# EasyEDA Pro project PCB_Board.epro

# Board PCB_Board
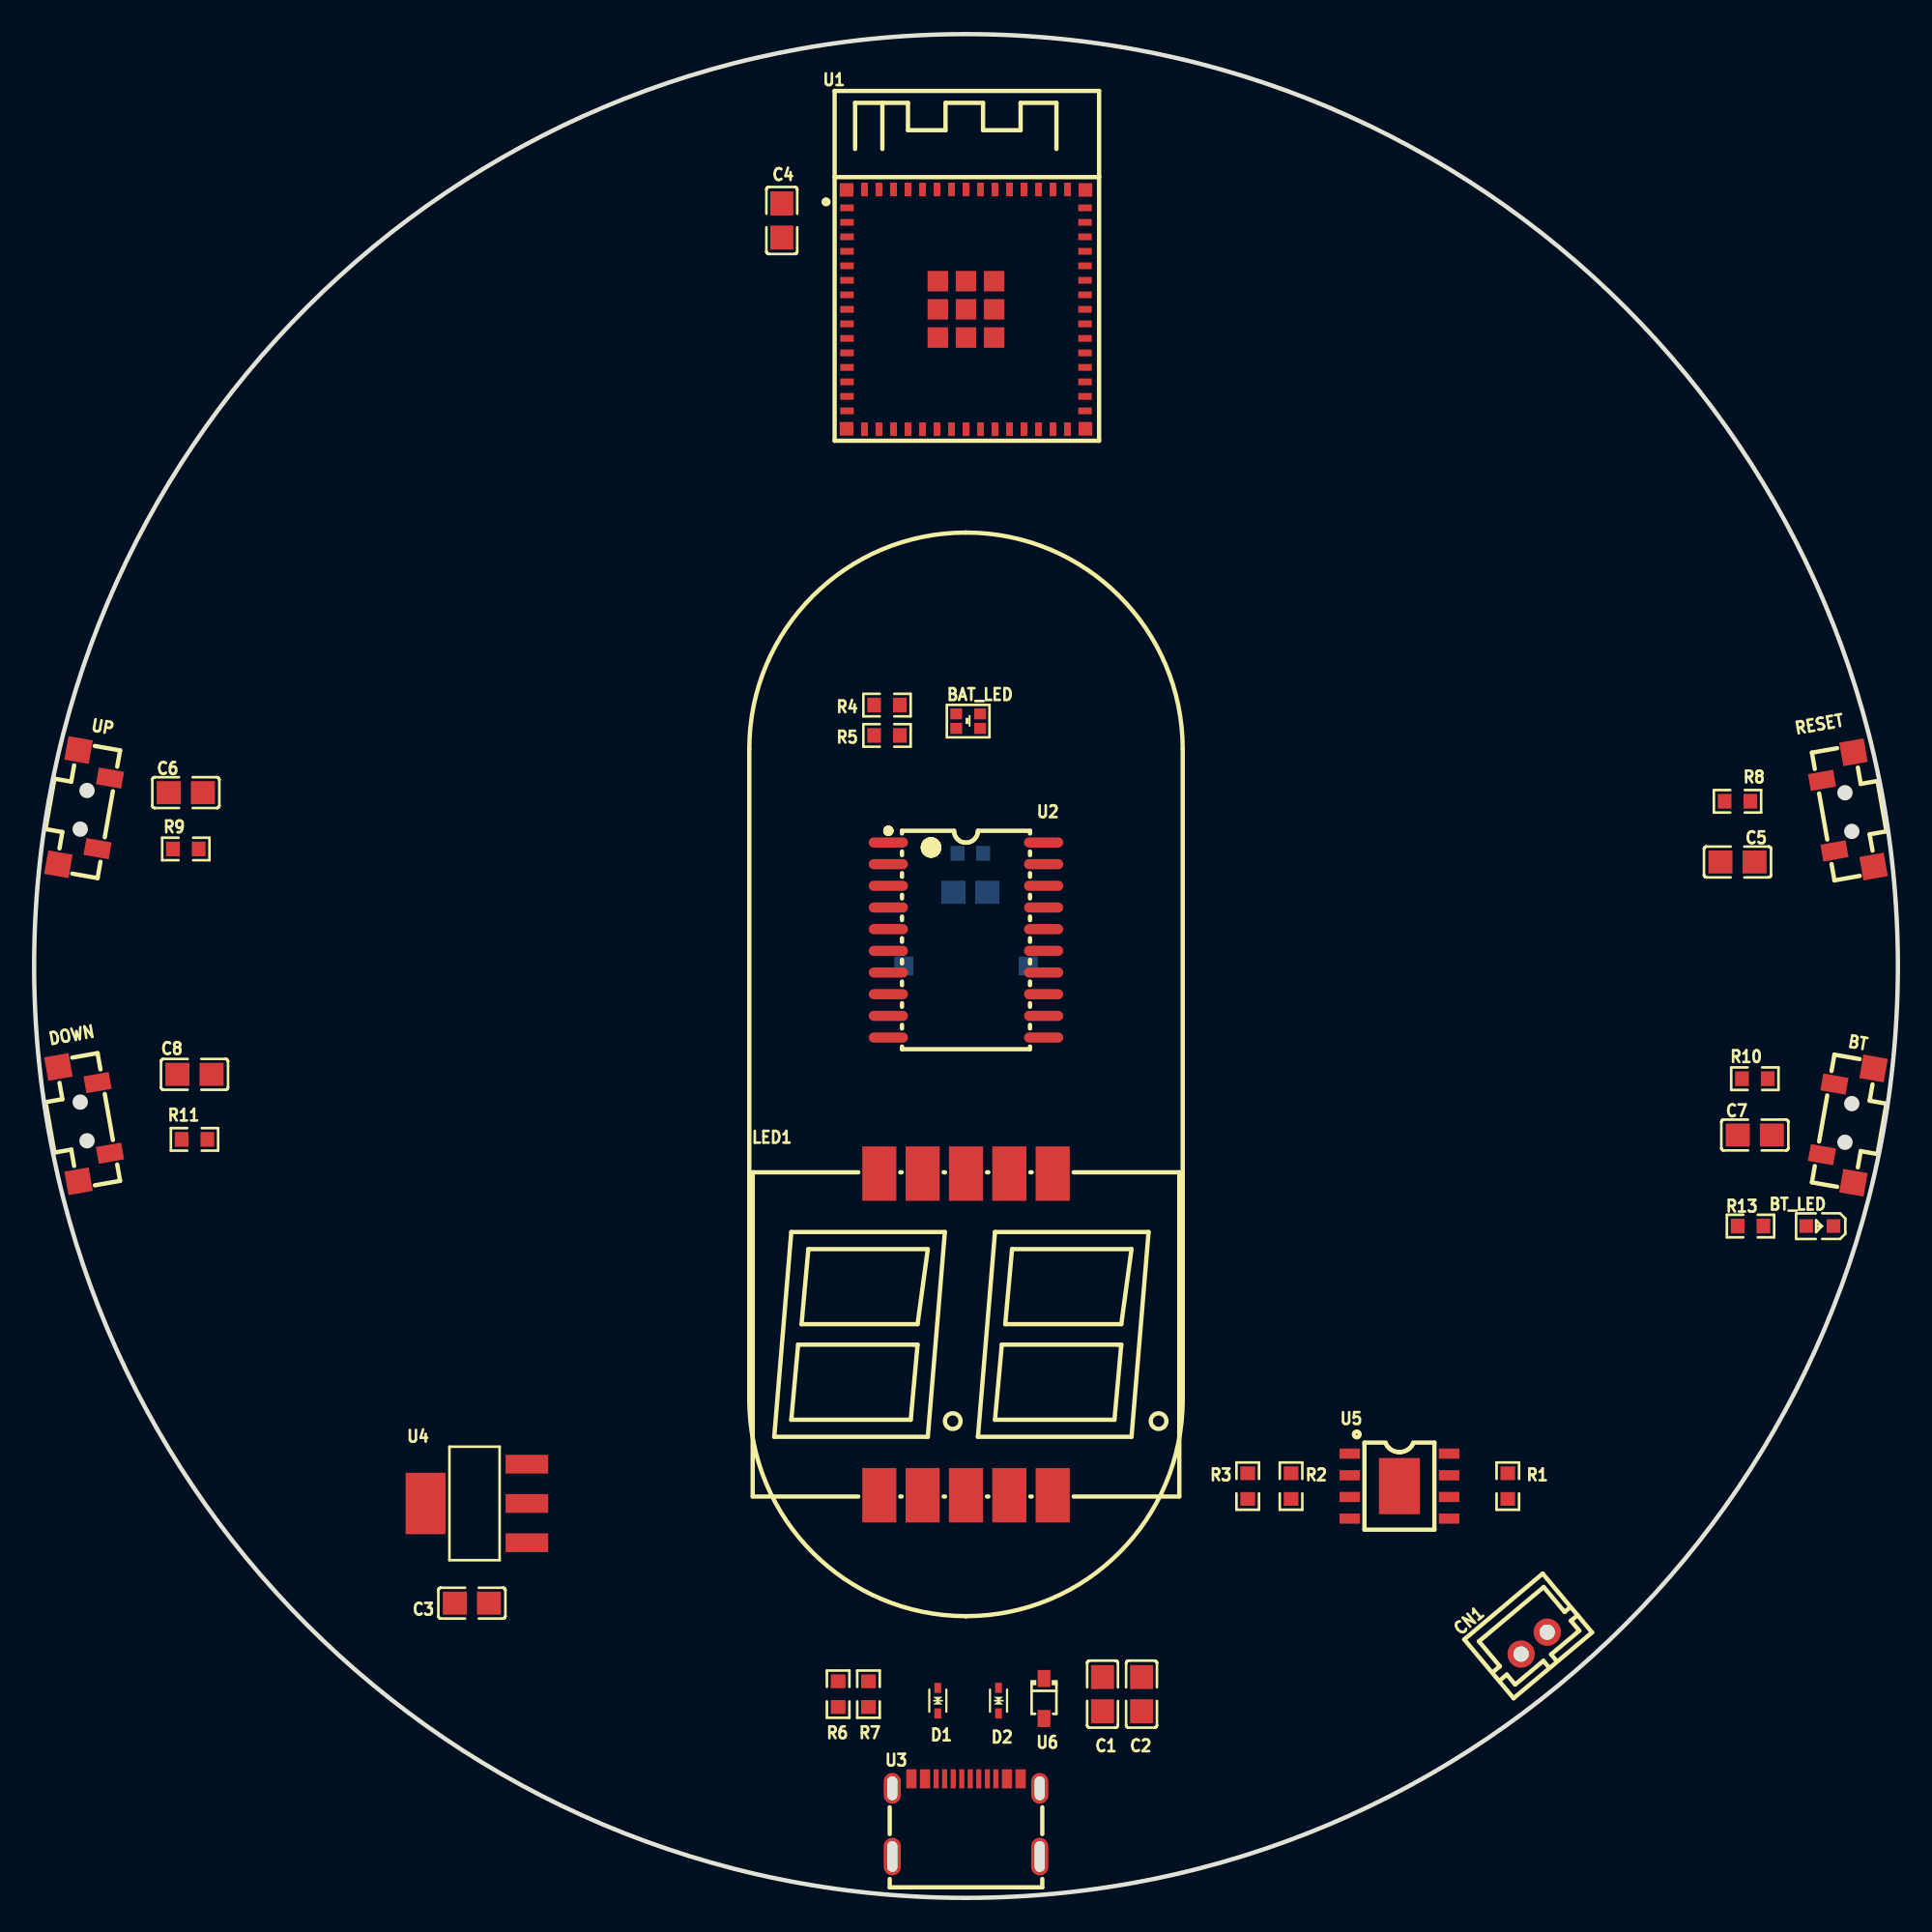
[diagram p0: board, top side]
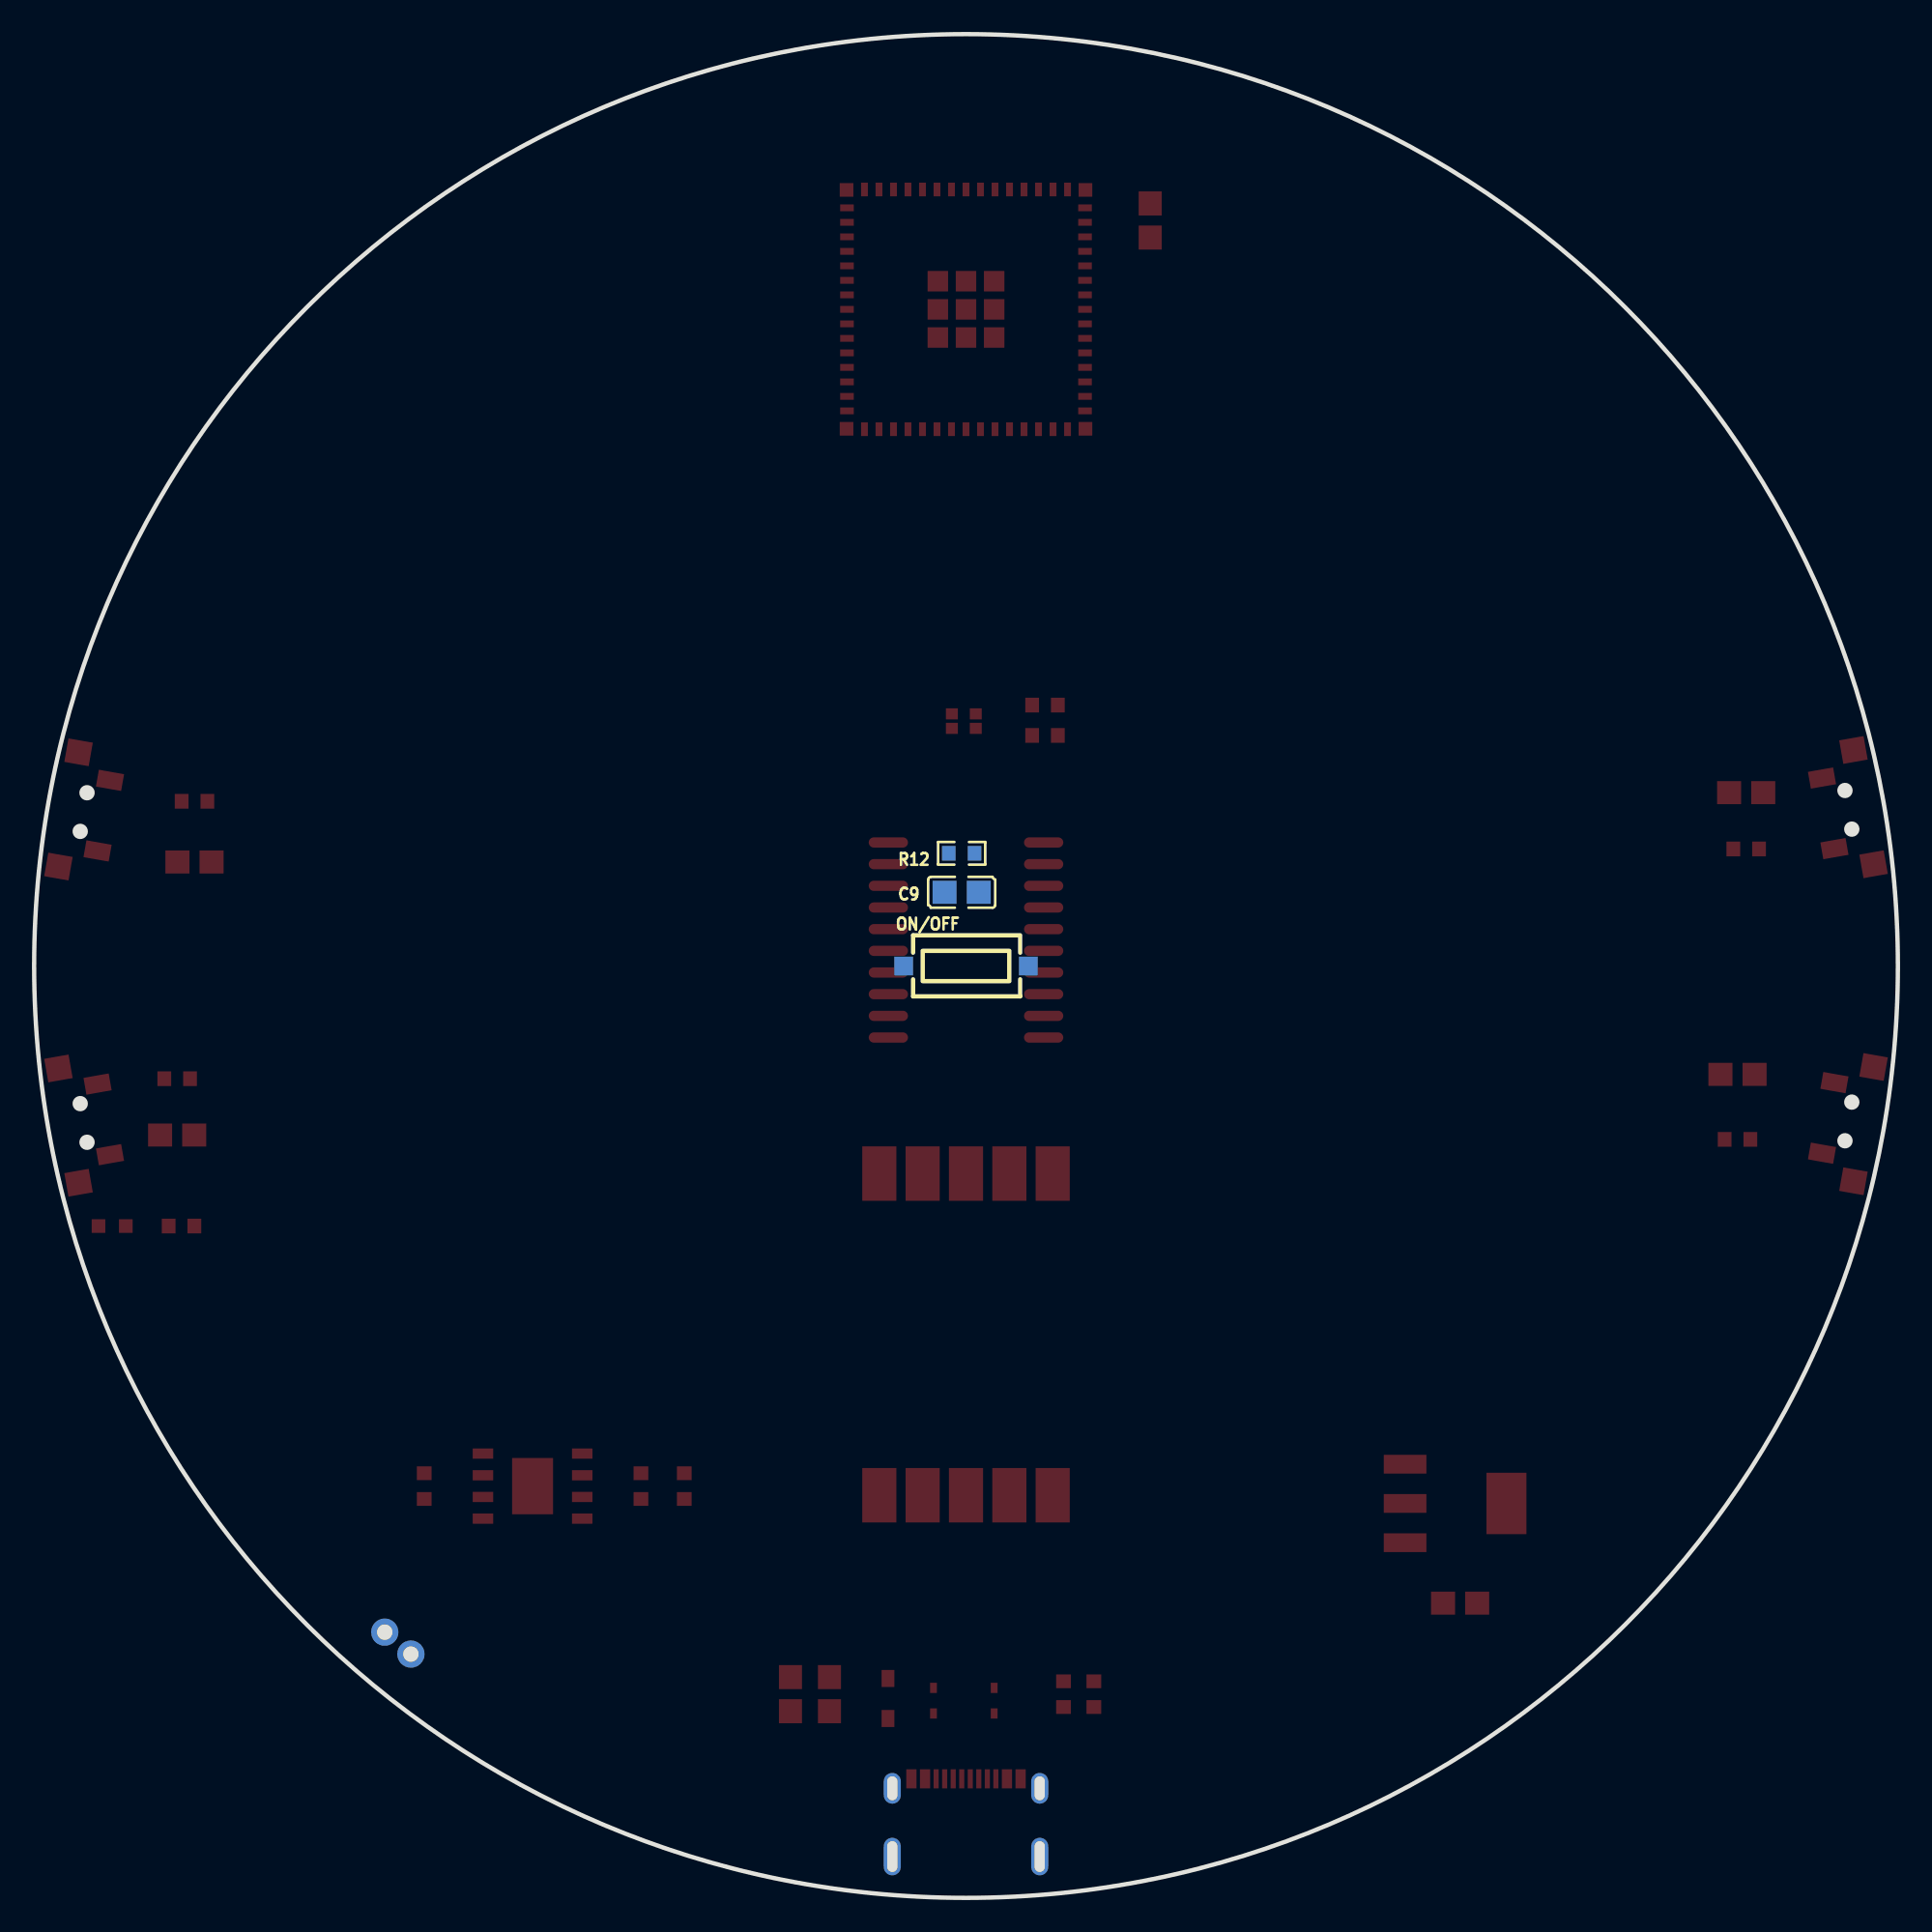
[diagram p1: board, bottom side, seen from below]

Outline 109.22 x 109.22 mm; copper layers: Top Layer, Bottom Layer. Coordinates in mm from the lower left corner of the outline.
Outline path: circle c54.61,54.61 r54.61
Stack: Top Layer 0.035mm / Dielectric1 1.51mm FR4 er 4.5 / Bottom Layer 0.035mm

## Design rules (mm)
template: JLCPCB Capability(Two Layers Board)
spacing copperThickness1oz (default): track to track 0.102, other pairs 0.152 to 0.3
spacing copperThickness2oz: track to track 0.203, other pairs 0.152 to 0.3
track width copperThickness1oz (default): min 0.127, default 0.254, max 2.54
track width copperThickness2oz: min 0.203, default 0.254, max 2.54
differential pair differentialPair (default): width min 0.127, default 0.254, max 2.54; gap min 0.152, default 0.152
via viaSize (default): diameter min 0.5, default 0.61, max 10; hole min 0.3, default 0.305, max 6.3

## Placement (name value [footprint] x y rotation side)
BAT_LED  19-223/R6BHC-A05/2T  [LED-ARRAY-SMD_4P-L1.6-W1.3-BR-FD]  54.74 68.96 0 top
BT  1TS002G-2500-3500-CT  [SW-SMD_1TS002G-XXXX-3500-CT]  106.17 45.44 80 top
BT_LED  D-060306B1  [LED0603-RD]  104.65 39.37 180 top
C1  100nF  [C0805]  62.61 11.94 90 top
C2  10uF  [C0805]  64.9 11.94 90 top
C3  100nF  [C0805]  25.65 17.27 0 top
C4  100nF  [C0805]  43.81 98.3 270 top
C5  100nF  [C0805]  99.82 60.71 180 top
C6  100nF  [C0805]  8.89 64.77 0 top
C7  100nF  [C0805]  100.84 44.7 180 top
C8  100nF  [C0805]  9.4 48.26 0 top
C9  100nF  [C0805]  54.86 58.93 180 bottom
CN1  B2B-PH-K-S(LF)(SN)  [CONN-TH_B2B-PH-K-S]  87.91 14.93 40 top
D1  LESD5D5.0CT1G  [SOD-523_L1.2-W0.8-LS1.6-BI]  52.96 11.56 90 top
D2  LESD5D5.0CT1G  [SOD-523_L1.2-W0.8-LS1.6-BI]  56.51 11.56 90 top
DOWN  1TS002G-2500-3500-CT  [SW-SMD_1TS002G-XXXX-3500-CT]  3.05 45.53 280 top
LED1  GS5620AG-G  [LED-SEG-SMD_10P-L25.1-W19.0-P2.54-S18.85-BL-1]  54.61 33.02 0 top
ON/OFF  HX 3x6x2.5A-2.5N  [SW-SMD_HX-TS-1101-C-W]  54.61 54.61 180 bottom
R1  0Ω  [R0603]  86.36 24.13 270 top
R2  10K  [R0603]  73.66 24.13 270 top
R3  NTC  [R0603]  71.12 24.13 90 top
R4  1K  [R0603]  49.98 69.9 0 top
R5  1K  [R0603]  49.98 68.12 0 top
R6  5K1  [R0603]  47.12 11.94 270 top
R7  5K1  [R0603]  48.89 11.94 270 top
R8  10K  [R0603]  99.82 64.26 180 top
R9  10K  [R0603]  8.89 61.47 0 top
R10  10K  [R0603]  100.84 48.01 180 top
R11  10K  [R0603]  9.4 44.45 0 top
R12  10K  [R0603]  54.86 61.21 0 bottom
R13  4K7  [R0603]  100.58 39.37 180 top
RESET  1TS002G-2500-3500-CT  [SW-SMD_1TS002G-XXXX-3500-CT]  106.17 63.6 100 top
U1  2.4GHz  [BULETM-SMD_ESP32-S3-MINI-1-N8]  54.61 93.09 0 top
U2  TM1637  [SOP-20_L12.8-W7.5-P1.27-LS10.4-BL]  54.61 56.13 270 top
U3  UC.01.51-11-0017,typec  [TYPE-C-SMD_UC.01.51-11-0017]  54.61 4.7 0 top
U4  AMS1117-3.3  [SOT-223-3_L6.5-W3.4-P2.30-LS7.0-BR]  25.91 23.11 0 top
U5  TP4056  [ESOP-8_L4.9-W3.9-P1.27-LS6.0-BL-EP]  80.01 24.13 270 top
U6  BAV19WS  [SOD-323_L1.8-W1.3-LS2.5-RD-1]  59.18 11.68 270 top
UP  1TS002G-2500-3500-CT  [SW-SMD_1TS002G-XXXX-3500-CT]  3.05 63.74 260 top

## Footprints (pads in the part's own frame, mm; a bottom-side part is the same pattern mirrored in y, then rotated)
BULETM-SMD_ESP32-S3-MINI-1-N8
  rect 0.8x0.4 smd: 1(-6.975,5.95) 2(-6.975,5.1) 3(-6.975,4.25) 4(-6.975,3.4) 5(-6.975,2.55) 6(-6.975,1.7) 7(-6.975,0.85) 8(-6.975,0) 9(-6.975,-0.85) 10(-6.975,-1.7) 11(-6.975,-2.55) 12(-6.975,-3.4) 13(-6.975,-4.25) 14(-6.975,-5.1) 15(-6.975,-5.95) 31(6.975,-5.95) 32(6.975,-5.1) 33(6.975,-4.25) 34(6.975,-3.4) 35(6.975,-2.55) 36(6.975,-1.7) 37(6.975,-0.85) 38(6.975,0) 39(6.975,0.85) 40(6.975,1.7) 41(6.975,2.55) 42(6.975,3.4) 43(6.975,4.25) 44(6.975,5.1) 45(6.975,5.95)
  rect 0.4x0.8 smd: 16(-5.95,-7.025) 17(-5.1,-7.025) 18(-4.25,-7.025) 19(-3.4,-7.025) 20(-2.55,-7.025) 21(-1.7,-7.025) 22(-0.85,-7.025) 23(0,-7.025) 24(0.85,-7.025) 25(1.7,-7.025) 26(2.55,-7.025) 27(3.4,-7.025) 28(4.25,-7.025) 29(5.1,-7.025) 30(5.95,-7.025) 46(5.95,7.025) 47(5.1,7.025) 48(4.25,7.025) 49(3.4,7.025) 50(2.55,7.025) 51(1.7,7.025) 52(0.85,7.025) 53(0,7.025) 54(-0.85,7.025) 55(-1.7,7.025) 56(-2.55,7.025) 57(-3.4,7.025) 58(-4.25,7.025) 59(-5.1,7.025) 60(-5.95,7.025)
  rect 0.8x0.8 smd: GND(-7,7) GND(-7,-7) GND(7,7) GND(7,-7)
  rect 1.2x1.2 smd: GND(-1.65,1.65) GND(-1.65,0) GND(-1.65,-1.65) GND(0,1.65) GND(0,0) GND(0,-1.65) GND(1.65,1.65) GND(1.65,0) GND(1.65,-1.65)
C0805
  rect 1.41x1.35 smd: 1(-1,0) 2(1,0)
CONN-TH_B2B-PH-K-S
  round 1.6 hole 0.9: 1(1,0) 2(-1,0)
ESOP-8_L4.9-W3.9-P1.27-LS6.0-BL-EP
  rect 0.6x1.2 smd: 1(-1.905,-2.909) 2(-0.635,-2.909) 3(0.635,-2.909) 4(1.905,-2.909) 5(1.905,2.909) 6(0.635,2.909) 7(-0.635,2.909) 8(-1.905,2.909)
  rect 3.3x2.4 smd: 9(0,0)
LED0603-RD
  rect 0.8x0.8 smd: 1(-0.799,0) 2(0.799,0)
LED-ARRAY-SMD_4P-L1.6-W1.3-BR-FD
  rect 0.7x0.65 smd: 1(0.7,-0.425) 2(-0.7,-0.425) 3(0.7,0.425) 4(-0.7,0.425)
LED-SEG-SMD_10P-L25.1-W19.0-P2.54-S18.85-BL-1
  rect 2x3.19 smd: 1(-5.08,-9.425) 2(-2.54,-9.425) 3(0,-9.425) 4(2.54,-9.425) 5(5.08,-9.425) 6(5.08,9.425) 7(2.54,9.425) 8(0,9.425) 9(-2.54,9.425) 10(-5.08,9.425)
R0603
  rect 0.806x0.864 smd: 1(-0.753,0) 2(0.753,0)
SOD-323_L1.8-W1.3-LS2.5-RD-1
  rect 1x0.75 smd: 1(-1.173,0) 2(1.173,0)
SOD-523_L1.2-W0.8-LS1.6-BI
  rect 0.6x0.4 smd: 1(-0.75,0) 2(0.75,0)
SOP-20_L12.8-W7.5-P1.27-LS10.4-BL
  oval 0.6x2.3 smd: 1(-5.715,-4.55) 2(-4.445,-4.55) 3(-3.175,-4.55) 4(-1.905,-4.55) 5(-0.635,-4.55) 6(0.635,-4.55) 7(1.905,-4.55) 8(3.175,-4.55) 9(4.445,-4.55) 10(5.715,-4.55) 11(5.715,4.55) 12(4.445,4.55) 13(3.175,4.55) 14(1.905,4.55) 15(0.635,4.55) 16(-0.635,4.55) 17(-1.905,4.55) 18(-3.175,4.55) 19(-4.445,4.55) 20(-5.715,4.55)
SOT-223-3_L6.5-W3.4-P2.30-LS7.0-BR
  rect 2.5x1.1 smd: 1(2.97,-2.3) 2(2.97,0) 3(2.97,2.3)
  rect 2.34x3.6 smd: 4(-2.97,0)
SW-SMD_1TS002G-XXXX-3500-CT
  rect 1x1.5 smd: 1(-2.1,1.05) 2(2.1,1.05)
  rect 1.4x1.45 smd: 3(-3.4,-1.05) 4(3.4,-1.05)
SW-SMD_HX-TS-1101-C-W
  rect 1.1x1.1 smd: 1(-3.65,0) 2(3.65,0)
TYPE-C-SMD_UC.01.51-11-0017
  rect 0.6x1.12 smd: A1B12(-3.2,2.277) A4B9(-2.4,2.277) B1A12(3.2,2.277) B4A9(2.4,2.277)
  rect 0.3x1.12 smd: A5(-1.25,2.277) A6(-0.25,2.277) A7(0.25,2.277) A8(1.25,2.277) B5(1.75,2.277) B6(0.75,2.277) B7(-0.75,2.277) B8(-1.75,2.277)
  oval 1x1.8 hole 0.6x1.4: EH1(-4.32,1.722) EH1(4.32,1.722)
  oval 1x2.2 hole 0.6x1.8: EH1(-4.32,-2.277) EH1(4.32,-2.277)

## Nets
3V3: C3.2 C4.2 R8.2 R9.2 R10.2 R11.2 R12.2 U1.3 U4.2 U4.4
GND: BT.1 BT.3 BT.4 BT_LED.1 C1.1 C2.1 C3.1 C4.1 C5.1 C6.1 C7.1 C8.1 C9.1 CN1.2 D1.1 D2.1 DOWN.1 DOWN.3 DOWN.4 ON/OFF.1 R2.2 R3.1 R6.1 R7.1 RESET.1 RESET.3 RESET.4 U1.1 U1.2 U1.42 U1.43 U1.46 U1.47 U1.48 U1.49 U1.50 U1.51 U1.52 U1.53 U1.54 U1.55 U1.56 U1.57 U1.58 U1.59 U1.60 U1.GND U2.1 U3.A1B12 U3.B1A12 U3.EH1 U4.1 U5.3 U5.9 UP.1 UP.3 UP.4
VBATT: CN1.1 U2.16 U4.3 U5.5
VBUS: C1.2 C2.2 R1.2 U6.1
BT: BT.2 C7.2 R10.1 U1.8
CE: R1.1 U5.4 U5.8
CLK: U1.5 U2.18
DIO: U1.6 U2.17
DOWN: C8.2 DOWN.2 R11.1 U1.10
G_LED: BAT_LED.1 U1.13
ON/OFF: C9.2 ON/OFF.2 R12.1 U1.11
R_LED: BAT_LED.3 U1.14
RESET: C5.2 R8.1 RESET.2 U1.45
UP: C6.2 R9.1 U1.9 UP.2
USB+: D1.2 U1.24 U3.A6 U3.B6
USB-: D2.2 U1.25 U3.A7 U3.B7
$1N2473: U3.A4B9 U3.B4A9 U6.2
$1N2880: R2.1 U5.2
$1N2967: R3.2 U5.1
$1N3097: BAT_LED.4 R4.2
$1N3101: BAT_LED.2 R5.2
$1N3124: R4.1 U5.7
$1N3131: R5.1 U5.6
$1N4075: R6.2 U3.A5
$1N4092: R7.2 U3.B5
$1N4417: LED1.2 U2.9
$1N4428: LED1.1 U2.8
$1N4435: LED1.4 U2.7
$1N4448: LED1.3 U2.2
$1N4458: LED1.9 U2.3
$1N4465: LED1.8 U2.4
$1N4476: LED1.6 U2.5
$1N4488: LED1.7 U2.6
$1N4537: LED1.10 U2.15
$1N4549: LED1.5 U2.14
$1N5816: BT_LED.2 R13.1
$1N5820: R13.2 U1.12

Pads without a net: U1 4 7 15 16 17 18 19 20 21 22 23 26 27 28 29 30 31 32 33 34 35 36 37 38 39 40 41 44; U2 10 11 12 13 19 20; U3 A8 B8
